# Altium project HIL_RIG_Hardware.PrjPcb (part 9 of 11)

## Sheet  12V.SchDoc
size A3; SheetNumber: 23; SheetTotal: 29; SPICEModelCacheJKCRVRTA: <root> / <DocumentId>JKCRVRTA</DocumentId> / </root>
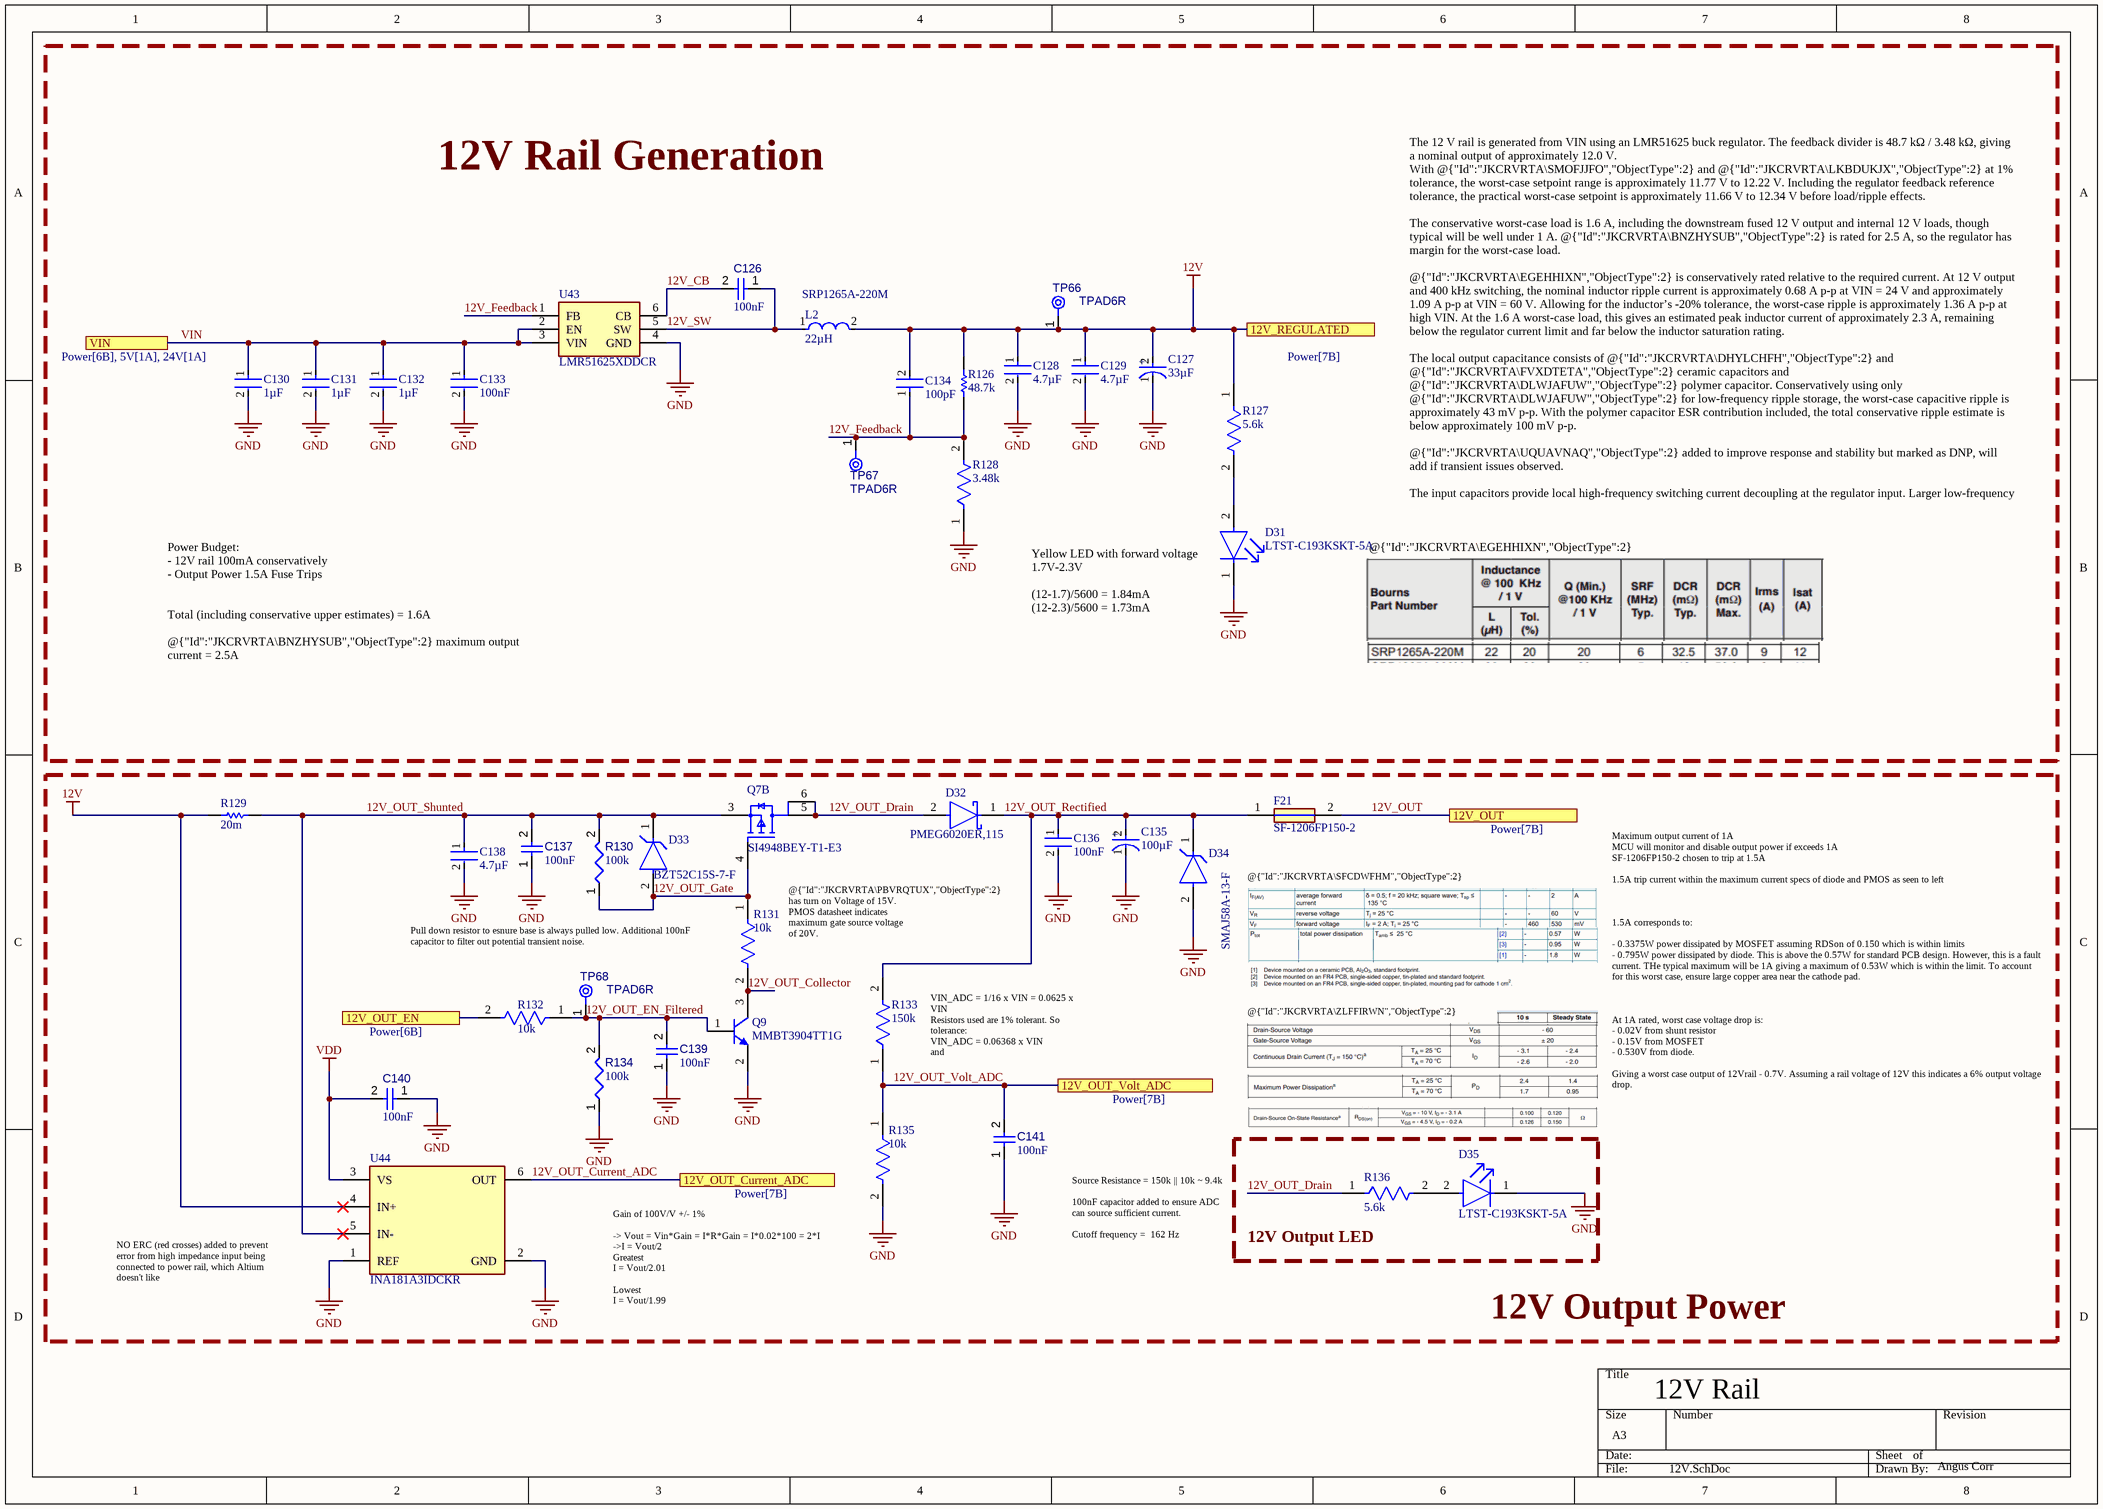
[diagram p21:  12V.SchDoc]

### Parts
C126  value 100nF  [CAPC1608X90X40NL10T20]  (hidden comment: Capacitor 100 nF +/-10% 50 V 0603)
C127  value 33µF  [FP-EEH-D8-MFG]  (hidden comment: EEHZA1H330XP)
C128  value 4.7µF  [FP-GRM21B-0_2-e0_2_0_7-MFG]  (hidden comment: GRM21BZ71H475KE15L)
C129  value 4.7µF  [FP-GRM21B-0_2-e0_2_0_7-MFG]  (hidden comment: GRM21BZ71H475KE15L)
C130  value 1µF  [FP-GRJ21B-0_35-MFG]  (hidden comment: GRJ21BC72A105KE11L)
C131  value 1µF  [FP-GRJ21B-0_35-MFG]  (hidden comment: GRJ21BC72A105KE11L)
C132  value 1µF  [FP-GRJ21B-0_35-MFG]  (hidden comment: GRJ21BC72A105KE11L)
C133  value 100nF  [FP-GRM31C-0_2-e0_3_0_8-IPC_C]  (hidden comment: GRM31C5C2A104JA01L)
C134  value 100pF  [FP-C0603C-CF-IPC_B]  (hidden comment: C0603C101F5HACTU)
C135  value 100µF  [FP-MVYAKE0-MFG]  (hidden comment: EMVY101ARA101MKE0S)
C136  value 100nF  [FP-GRM31C-0_2-e0_3_0_8-IPC_C]  (hidden comment: GRM31C5C2A104JA01L)
C137  value 100nF  [CAPC1608X90X40NL10T20]  (hidden comment: Capacitor 100 nF +/-10% 50 V 0603)
C138  value 4.7µF  [FP-GRM21B-0_2-e0_2_0_7-MFG]  (hidden comment: GRM21BZ71H475KE15L)
C139  value 100nF  [CAPC1608X90X40NL10T20]  (hidden comment: Capacitor 100 nF +/-10% 50 V 0603)
C140  value 100nF  [CAPC1608X90X40NL10T20]  (hidden comment: Capacitor 100 nF +/-10% 50 V 0603)
C141  value 100nF  [CAPC1608X90X40NL10T20]  (hidden comment: Capacitor 100 nF +/-10% 50 V 0603)
D31  LTST-C193KSKT-5A  [FP-LTST-C193KGKT-5A-MFG]
D32  PMEG6020ER,115  [FP-SOD123W-MFG]
D33  BZT52C15S-7-F  [FP-SOD323-IPC_A]
D34  SMAJ58A-13-F  [FP-SMA-MFG]
D35  LTST-C193KSKT-5A  [FP-LTST-C193KGKT-5A-MFG]
F21  SF-1206FP150-2  [FUSC3116X70N]
L2  value 22µH  [FP-SRP1265A-MFG]  (hidden comment: SRP1265A-220M)
Q7  SI4948BEY-T1-E3  [FP-C-06527-IPC_B]  (part B of 2)
Q9  MMBT3904TT1G  [ONSC-SC-75-3-463-01_V]
R126  value 48.7k  [RESC1608X55X25ML10T15]  (hidden comment: RC0603FR-0748K7L)
R127  value 5.6k  [FP-RT0603-IPC_C]  (hidden comment: RT0603FRE075K6L)
R128  value 3.48k  [FP-AC0603-IPC_C]  (hidden comment: AC0603FR-073K48L)
R129  value 20m  [RESC3216X89X51NL25T25]  (hidden comment: WSL1206R0200FEA)
R130  value 100k  [FP-AC0603-IPC_C]  (hidden comment: AC0603FR-07100KL)
R131  value 10k  [FP-RT0603-IPC_C]  (hidden comment: RT0603BRD0710KL)
R132  value 10k  [FP-RT0603-IPC_C]  (hidden comment: RT0603BRD0710KL)
R133  value 150k  [FP-CRGCQ0603-IPC_A]  (hidden comment: CRGCQ0603F150K)
R134  value 100k  [FP-AC0603-IPC_C]  (hidden comment: AC0603FR-07100KL)
R135  value 10k  [FP-RT0603-IPC_C]  (hidden comment: RT0603BRD0710KL)
R136  value 5.6k  [FP-RT0603-IPC_C]  (hidden comment: RT0603FRE075K6L)
TP66  TPAD6R  [TP06R]  (no BOM)
TP67  TPAD6R  [TP06R]  (no BOM)
TP68  TPAD6R  [TP06R]  (no BOM)
U43  LMR51625XDDCR  [SOT95P280X110-6N]
U44  INA181A3IDCKR  [FP-DCK0006A-IPC_A]

### Blocks framed on the sheet
12V Rail Generation: C126-C134 D31 L2 R126-R128 TP66 TP67 U43
12V Output Power: C135-C141 D32-D34 F21 Q7 Q9 R129-R135 TP68 U44
12V Output LED: D35 R136

### Ports
12V_OUT (see Power[7B]), 12V_OUT_Current_ADC (see Power[7B]), 12V_OUT_EN (see Power[6B]), 12V_OUT_Volt_ADC (see Power[7B]), 12V_REGULATED (see Power[7B]), VIN (see Power[6B], 5V[1A], 24V[1A])

### Nets
12V: C127.2(A) C128.1 C129.1 C134.2 L2.2 R126.2 R127.1 R129.1 TP66.1(TP) U44.4(IN+) ; port 12V_REGULATED
GND: C127.1(C) C128.2 C129.2 C130.2 C131.2 C132.2 C133.2 C135.1(C) C136.2 C137.1 C138.2 C139.1 C140.1 C141.1 D31.1(C) D34.2(A) D35.1(C) Q9.2(E) R128.1 R134.1 R135.2 U43.4(GND) U44.1(REF) U44.2(GND)
VDD: C140.2 U44.3(VS)
12V_CB: C126.2 U43.6(CB)
12V_Feedback: C134.1 R126.1 R128.2 TP67.1(TP) U43.1(FB)
12V_OUT: F21.2 ; port 12V_OUT
12V_OUT_Collector: Q9.3(C) R131.2
12V_OUT_Current_ADC: U44.6(OUT) ; port 12V_OUT_Current_ADC
12V_OUT_Drain: D32.2(A) Q7.5(D2) Q7.6(D2) R136.1
12V_OUT_EN_Filtered: C139.2 Q9.1(B) R132.1 R134.2 TP68.1(TP)
12V_OUT_Gate: D33.2(A) Q7.4(G2) R130.1 R131.1
12V_OUT_Rectified: C135.2(A) C136.1 D32.1(C) D34.1(C) F21.1 R133.2
12V_OUT_Shunted: C137.2 C138.1 D33.1(C) Q7.3(S2) R129.2 R130.2 U44.5(IN-)
12V_OUT_Volt_ADC: C141.2 R133.1 R135.1 ; port 12V_OUT_Volt_ADC
12V_SW: C126.1 L2.1 U43.5(SW)
VIN: C130.1 C131.1 C132.1 C133.1 U43.2(EN) U43.3(VIN) ; port VIN
NetD31_2: D31.2(A) R127.2
NetD35_2: D35.2(A) R136.2
NetR132_2: R132.2 ; port 12V_OUT_EN

### Notes on the sheet
- (near L2) SRP1265A-220M
- The 12 V rail is generated from VIN using an LMR51625 buck regulator. The feedback divider is 48.7 kΩ / 3.48 kΩ, giving a nominal output of approximately 12.0 V.
  With @{"Id":"JKCRVRTA\SMOFJJFO","ObjectType":2} and @{"Id":"JKCRVRTA\LKBDUKJX","ObjectType":2} at 1% tolerance, the worst-case setpoint range is approximately 11.77 V to 12.22 V. Including the regulator feedback reference tolerance, the practical worst-case setpoint is approximately 11.66 V to 12.34 V before load/ripple effects.
  The conservative worst-case load is 1.6 A, including the downstream fused 12 V output and internal 12 V loads, though typical will be well under 1 A. @{"Id":"JKCRVRTA\BNZHYSUB","ObjectType":2} is rated for 2.5 A, so the regulator has margin for the worst-case load.
  @{"Id":"JKCRVRTA\EGEHHIXN","ObjectType":2} is conservatively rated relative to the required current. At 12 V output and 400 kHz switching, the nominal inductor ripple current is approximately 0.68 A p-p at VIN = 24 V and approximately 1.09 A p-p at VIN = 60 V. Allowing for the inductor’s -20% tolerance, the worst-case ripple is approximately 1.36 A p-p at high VIN. At the 1.6 A worst-case load, this gives an estimated peak inductor current of approximately 2.3 A, remaining below the regulator current limit and far below the inductor saturation rating.
  The local output capacitance consists of @{"Id":"JKCRVRTA\DHYLCHFH","ObjectType":2} and @{"Id":"JKCRVRTA\FVXDTETA","ObjectType":2} ceramic capacitors and @{"Id":"JKCRVRTA\DLWJAFUW","ObjectType":2} polymer capacitor. Conservatively using only @{"Id":"JKCRVRTA\DLWJAFUW","ObjectType":2} for low-frequency ripple storage, the worst-case capacitive ripple is approximately 43 mV p-p. With the polymer capacitor ESR contribution included, the total conservative ripple estimate is below approximately 100 mV p-p.
  @{"Id":"JKCRVRTA\UQUAVNAQ","ObjectType":2} added to improve response and stability but marked as DNP, will add if transient issues observed.
  The input capacitors provide local high-frequency switching current decoupling at the regulator input. Larger low-frequency energy storage is provided by the upstream 100 µF bulk capacitance.
  VIN should remain comfortably above 12 V under load. In normal operation from the 24 V/VIN rail there is substantial duty-cycle margin, unlike the 24 V regulator which operates closer to dropout.
- @{"Id":"JKCRVRTA\EGEHHIXN","ObjectType":2} stats
- (near D31) Yellow LED with forward voltage 1.7V-2.3V
  (12-1.7)/5600 = 1.84mA
  (12-2.3)/5600 = 1.73mA
- Power Budget:
  - 12V rail 100mA conservatively
  - Output Power 1.5A Fuse Trips
  Total (including conservative upper estimates) = 1.6A
  @{"Id":"JKCRVRTA\BNZHYSUB","ObjectType":2} maximum output current = 2.5A
- @{"Id":"JKCRVRTA\SFCDWFHM","ObjectType":2} specs
- Pull down resistor to esnure base is always pulled low. Additional 100nF capacitor to filter out potential transient noise.
- @{"Id":"JKCRVRTA\PBVRQTUX","ObjectType":2} has turn on Voltage of 15V. PMOS datasheet indicates maximum gate source voltage of 20V.
- VIN_ADC = 1/16 x VIN = 0.0625 x VIN
  Resistors used are 1% tolerant. So tolerance:
  VIN_ADC = 0.06368 x VIN
  and
  VIN_ADC = 0.06238 x VIN
- @{"Id":"JKCRVRTA\ZLFFIRWN","ObjectType":2} specs
- Source Resistance = 150k || 10k ~ 9.4k
  100nF capacitor added to ensure ADC can source sufficient current.
  Cutoff frequency =  162 Hz
- Maximum output current of 1A
  MCU will monitor and disable output power if exceeds 1A
  SF-1206FP150-2 chosen to trip at 1.5A
  1.5A trip current within the maximum current specs of diode and PMOS as seen to left
  1.5A corresponds to:
  - 0.3375W power dissipated by MOSFET assuming RDSon of 0.150 which is within limits
  - 0.795W power dissipated by diode. This is above the 0.57W for standard PCB design. However, this is a fault current. THe typical maximum will be 1A giving a maximum of 0.53W which is within the limit. To account for this worst case, ensure large copper area near the cathode pad.
  At 1A rated, worst case voltage drop is:
  - 0.02V from shunt resistor
  - 0.15V from MOSFET
  - 0.530V from diode.
  Giving a worst case output of 12Vrail - 0.7V. Assuming a rail voltage of 12V this indicates a 6% output voltage drop.
- NO ERC (red crosses) added to prevent error from high impedance input being connected to power rail, which Altium doesn't like
- (near R135) Gain of 100V/V +/- 1%
  -> Vout = Vin*Gain = I*R*Gain = I*0.02*100 = 2*I
  ->I = Vout/2
  Greatest
  I = Vout/2.01
  Lowest
  I = Vout/1.99
- 12V Rail
- Angus Corr

### Library data of the parts
C126 C137 C139-C141 = CMP-001-00017-6: as C110 on sheet  24V; Tolerance: 10%; Mounting Technology: SM; Max Operating Temperature: 125°C; RoHS Compliant: True; Pins: 2; Case/Package: 0603; Min Operating Temperature: -55°C
C127 = CMP-001-00147-1: as C111 on sheet  24V; Max Operating Temperature: 105°C; Voltage Rating: 50V; Mounting Technology: Surface Mount; Pins: 8; Ripple Current: 1.6A; Tolerance: 20%; Min Operating Temperature: -55°C; Case/Package: Radial
C128 C129 C138 = CMP-001-00149-1: as C112 on sheet  24V; Case/Package: 0805; Tolerance: 10%; Voltage Rating: 50V; Min Operating Temperature: -55°C; Mounting Technology: Surface Mount; Max Operating Temperature: 125°C; Country of Origin: Japan, Mainland China, Philippines, Singapore, Thailand; Dielectric Material: Ceramic; Export Control Classification Number (ECCN) Code: EAR99; Harmonized Tariff Schedule (HTS) Code: 8532.24.00.20; Height: 1.25mm; Introduction Date: 2017-02-22; Length: 2mm; Lifecycle Status: Production; Material: Ceramic; Number of Terminals: 2; REACH SVHC: Yes; RoHS: Compliant; Thickness: 1.25mm; Voltage Rating (DC): 50V; Width: 1.25mm
C130-C132 = CMP-001-00143-2: as C114 on sheet  24V; Mounting Technology: Surface Mount; Voltage Rating: 100V; Max Operating Temperature: 125°C; Min Operating Temperature: -55°C; Tolerance: 10%; Case/Package: 0805; Case Code (Imperial): 0805; Case Code (Metric): 2012; Dielectric Material: Ceramic; Dielectric: X7S; Export Control Classification Number (ECCN) Code: EAR99; Features: Soft Termination; Harmonized Tariff Schedule (HTS) Code: 8532.24.00.20; Height: 1.25mm; Introduction Date: 2015-11-10; Length: 2mm; Lifecycle Status: Production; Material: Ceramic; Number of Terminals: 2; Packaging: Cut Tape; REACH SVHC: Yes; RoHS: Compliant; Schedule B: 8532240020, 8532240020; Thickness: 1.25mm; Voltage Rating (DC): 100V; Width: 1.25mm
C133 C136 = CMP-001-00103-1: as C117 on sheet  24V; Min Operating Temperature: -55°C; Mounting Technology: Surface Mount; Case/Package: 1206; Max Operating Temperature: 125°C; Tolerance: 5%; Voltage Rating: 100V
C134 = CMP-001-00115-1: Multilayer Ceramic Capacitors MLCC - SMD/SMT 50V 100pF X8R 0603 1%; Temperature Coefficient: 30ppm/°C; Lead Free: Lead Free; Width: 800µm; Schedule B: 8532240020, 8532240020; Introduction Date: 2017-10-02; Harmonized Tariff Schedule (HTS) Code: 8532.24.00.20; Voltage Rating (DC): 50V; Lifecycle Status: Production; Number of Terminals: 2; Height: 800µm; REACH SVHC: Yes; Dielectric Material: Ceramic; Country of Origin: Mexico; Voltage Rating: 50V; Mounting Technology: Surface Mount; Length: 1.6mm; China RoHS: Compliant; RoHS: Compliant; Case/Package: 0603; Max Operating Temperature: 150°C; Export Control Classification Number (ECCN) Code: EAR99; Dielectric: X8R; Material: Ceramic; Min Operating Temperature: -55°C
C135 = CMP-001-00104-1: as C119 on sheet  24V; Mounting Technology: Surface Mount; Ripple Current: 450mA; Tolerance: 20%; Case/Package: SMD/SMT; Pins: 2; Max Operating Temperature: 105°C; Min Operating Temperature: -40°C; Voltage Rating: 100V; Ripple Current (AC): 450mA
D31 D35 = CMP-007-00044-1: as D26 on sheet  24V; Schedule B: 8541402000, 8541402000; Introduction Date: 2007-04-09; Min Operating Temperature: -55°C; RoHS: Compliant; Terminal Pitch: 1.5mm; Case/Package: 0603; Width: 800µm; Dominant Wavelength: 594.5nm; Pins: 2; Case Code (Imperial): 0603; Height: 350µm; Length: 1.6mm; Color: Yellow; Lead Free: Lead Free; Max Operating Temperature: 85°C; Wavelength: 594.5nm; Harmonized Tariff Schedule (HTS) Code: 8541.40.20.00; China RoHS: Compliant; Illumination Color: Yellow; Number of Terminals: 2; Radiation Hardening: No; Case Code (Metric): 1608; Number of LEDs: 1; Depth: 800µm; Lifecycle Status: Production; REACH SVHC: Yes; Mounting Technology: Surface Mount; Number of Elements: 1
D32 = CMP-004-00064-1: as D27 on sheet  24V; Min Operating Temperature: -55°C; Max Operating Temperature: 150°C; Pins: 2
D33 = CMP-004-00045-1: as D28 on sheet  24V; Pins: 2; Max Operating Temperature: 150°C; Mounting Technology: Surface Mount; Min Operating Temperature: -65°C
D34 = CMP-004-00082-1: as D29 on sheet  24V; Case/Package: SMA; Max Operating Temperature: 150°C; Min Operating Temperature: -55°C; Mounting Technology: Surface Mount; Pins: 2
F21 = CMP-005-00025-1: as F20 on sheet  24V; Mouser Part Number: 652-SF-1206FP150-2; Mouser Price/Stock: https://www.mouser.co.uk/ProductDetail/Bourns/SF-1206FP150-2?qs=YCa%2FAAYMW02QT85STQYHfQ%3D%3D; Manufacturer_Part_Number: SF-1206FP150-2; Datasheet Link: https://www.arrow.com/en/products/sf-1206fp150-2/bourns; Source: MAX17643ATC+.SchLib; Arrow Part Number: SF-1206FP150-2; Design Item ID: SF-1206FP150-2; Height: 0.7mm; Arrow Price/Stock: https://www.arrow.com/en/products/sf-1206fp150-2/bourns?utm_currency=USD&region=nac
L2 = CMP-006-00026-1: Inductor Power Shielded Wirewound 22uH 20% 100KHz 20Q-Factor Carbonyl Powder 9A 0.037Ohm DCR Automotive T/R; Self Resonant Frequency: 6MHz; Min Operating Temperature: -55°C; Tolerance: 20%; Max Current Rating: 9A; Case/Package: Nonstandard; Max Operating Temperature: 150°C; Mounting Technology: Surface Mount; Current Rating: 9A
Q7 = CMP-013-00038-1: as Q7 on sheet  24V; Max Operating Temperature: 175°C; Mounting Technology: Surface Mount; Min Operating Temperature: -55°C; Case/Package: SO; Pins: 8
Q9 = CMP-013-00039-1: as Q8 on sheet  24V; Min Operating Temperature: -55°C; Max Operating Temperature: 150°C; Case/Package: SOT-416; Pins: 3
R126 = CMP-009-00329-1: Res Thick Film 0603 48.7K Ohm 1% 0.1W(1/10W) ±100ppm/C Pad SMD T/R; Working Voltage: 75V; Voltage Rating (DC): 50V; Temperature Coefficient: 100ppm/°C; Power Rating: 100mW; Length: 1.6mm; Lead Free: Lead Free; Composition: Thick Film; Termination: SMD/SMT; RoHS: Compliant; China RoHS: Non-Compliant; Depth: 800µm; Lifecycle Status: Production; Military Standard: Not; Min Operating Temperature: -55°C; Case Code (Imperial): 0603; Features: Moisture Resistant; Number of Terminals: 2; REACH SVHC: Yes; Mounting Technology: Surface Mount; Width: 800µm; Voltage Rating: 75V; Max Operating Temperature: 155°C; Max Power Dissipation: 100mW; Height: 450µm; Tolerance: 1%; Number of Terminations: 2; Schedule B: 8533210045, 8533210045; Case/Package: 0603
R127 R136 = CMP-009-00325-1: Fixed Resistor, Thin Film, 0.1W, 5600ohm, 75V, 1% +/-Tol, 50ppm/Cel, Surface Mount, 0603; Power Rating: 100mW; Temperature Coefficient: 50ppm/°C; Pins: 2; Tolerance: 1%; Lifecycle Status: Production; Composition: Thin Film; REACH SVHC: Yes; Working Voltage: 75V; Voltage Rating (DC): 75V; Case/Package: 0603; Voltage Rating: 75V; Mounting Technology: Surface Mount; Length: 1.6mm; Max Operating Temperature: 155°C; Number of Terminals: 2; Schedule B: 8533210045, 8533210045; Width: 800µm; China RoHS: Non-Compliant; Height: 450µm; Min Operating Temperature: -55°C; RoHS: Compliant; Case Code (Imperial): 0603; Depth: 800µm; Lead Free: Lead Free; Max Power Dissipation: 100mW; Military Standard: Not; Number of Terminations: 2; Termination: SMD/SMT
R128 = CMP-009-00282-1: as R117 on sheet  24V; Max Operating Temperature: 155°C; Mounting Technology: Surface Mount; Min Operating Temperature: -55°C; Tolerance: 1%; Case/Package: 0603
R129 = CMP-009-00308-1: as R118 on sheet  24V; Pins: 2; Min Operating Temperature: -65°C; Tolerance: 1%; Mounting Technology: Surface Mount; Max Operating Temperature: 170°C; Case/Package: 1206
R130 R134 = CMP-009-00345-3: as R115 on sheet  24V; Max Operating Temperature: 155°C; Tolerance: 1%; Case/Package: 0603; Mounting Technology: Surface Mount; Min Operating Temperature: -55°C; Case Code (Imperial): 0603; Case Code (Metric): 1608; China RoHS: Non-Compliant; Composition: Thick Film; Country of Origin: Mainland China, Taiwan; Depth: 800µm; Export Control Classification Number (ECCN) Code: EAR99; Features: Anti-Sulfur, Automotive AEC-Q200, Moisture Resistant; Harmonized Tariff Schedule (HTS) Code: 8533.21.00.30; Height: 450µm; Introduction Date: 2012-04-10; Lead Free: Lead Free; Length: 1.6mm; Lifecycle Status: Production; Military Standard: Not; Number of Terminals: 2; Number of Terminations: 2; Packaging: Tape & Reel; Power Rating: 100mW; Ratings: AEC-Q200; REACH SVHC: Yes; RoHS: Compliant; Schedule B: 8533210045, 8533210045; Termination: SMD/SMT; Width: 800µm; Working Voltage: 75V
R131 R132 R135 = CMP-009-00322-1: as R120 on sheet  24V; Min Operating Temperature: -55°C; Case/Package: 0603; Mounting Technology: Surface Mount; Max Operating Temperature: 155°C; Tolerance: 0.1%; Case Code (Imperial): 0603; China RoHS: Non-Compliant; Composition: Thin Film; Country of Origin: Mainland China, Taiwan; Depth: 800µm; Export Control Classification Number (ECCN) Code: EAR99; Features: Moisture Resistant; Harmonized Tariff Schedule (HTS) Code: 8533.21.00.30; Height: 450µm; Introduction Date: 2008-06-09; Lead Free: Lead Free; Length: 1.6mm; Lifecycle Status: Production; Military Standard: Not; Number of Terminals: 2; Number of Terminations: 2; Power Rating: 100mW; REACH SVHC: Yes; RoHS: Compliant; Schedule B: 8533210045, 8533210045; Termination: SMD/SMT; Voltage Rating (DC): 75V; Weight: 2.012816mg; Width: 800µm; Working Voltage: 75V
R133 = CMP-009-00207-1: as R122 on sheet  24V; Mounting Technology: Surface Mount; Case/Package: 0603; Min Operating Temperature: -55°C; Max Operating Temperature: 155°C; Tolerance: 1%
TP66-TP68 = CMP-00028-00002-2: 0.6mm round; Pins: 1
U43 = CMP-031-00022-1: as U41 on sheet  24V; Source: MAX17643ATC+.SchLib; Mouser Part Number: 595-LMR51625XDDCR; Manufacturer_Part_Number: LMR51625XDDCR; Arrow Price/Stock: https://www.arrow.com/en/products/lmr51625xddcr/texas-instruments.html?utm_currency=USD&region=nac; Mouser Price/Stock: https://www.mouser.co.uk/ProductDetail/Texas-Instruments/LMR51625XDDCR?qs=efUn273yAheKjJQ13bmSQQ%3D%3D; Height: 1.1mm; Datasheet Link: https://www.ti.com/lit/ds/symlink/lmr51625.pdf?ts=1740555768028; Arrow Part Number: LMR51625XDDCR; Design Item ID: LMR51625XDDCR
U44 = CMP-014-00006-1: as U42 on sheet  24V; Min Operating Temperature: -40°C; Pins: 6; Max Operating Temperature: 125°C

## Sheet  5V.SchDoc
size A3; SheetNumber: 24; SheetTotal: 29; SPICEModelCacheHUIZGDZF: <root> / <DocumentId>HUIZGDZF</DocumentId> / </root>
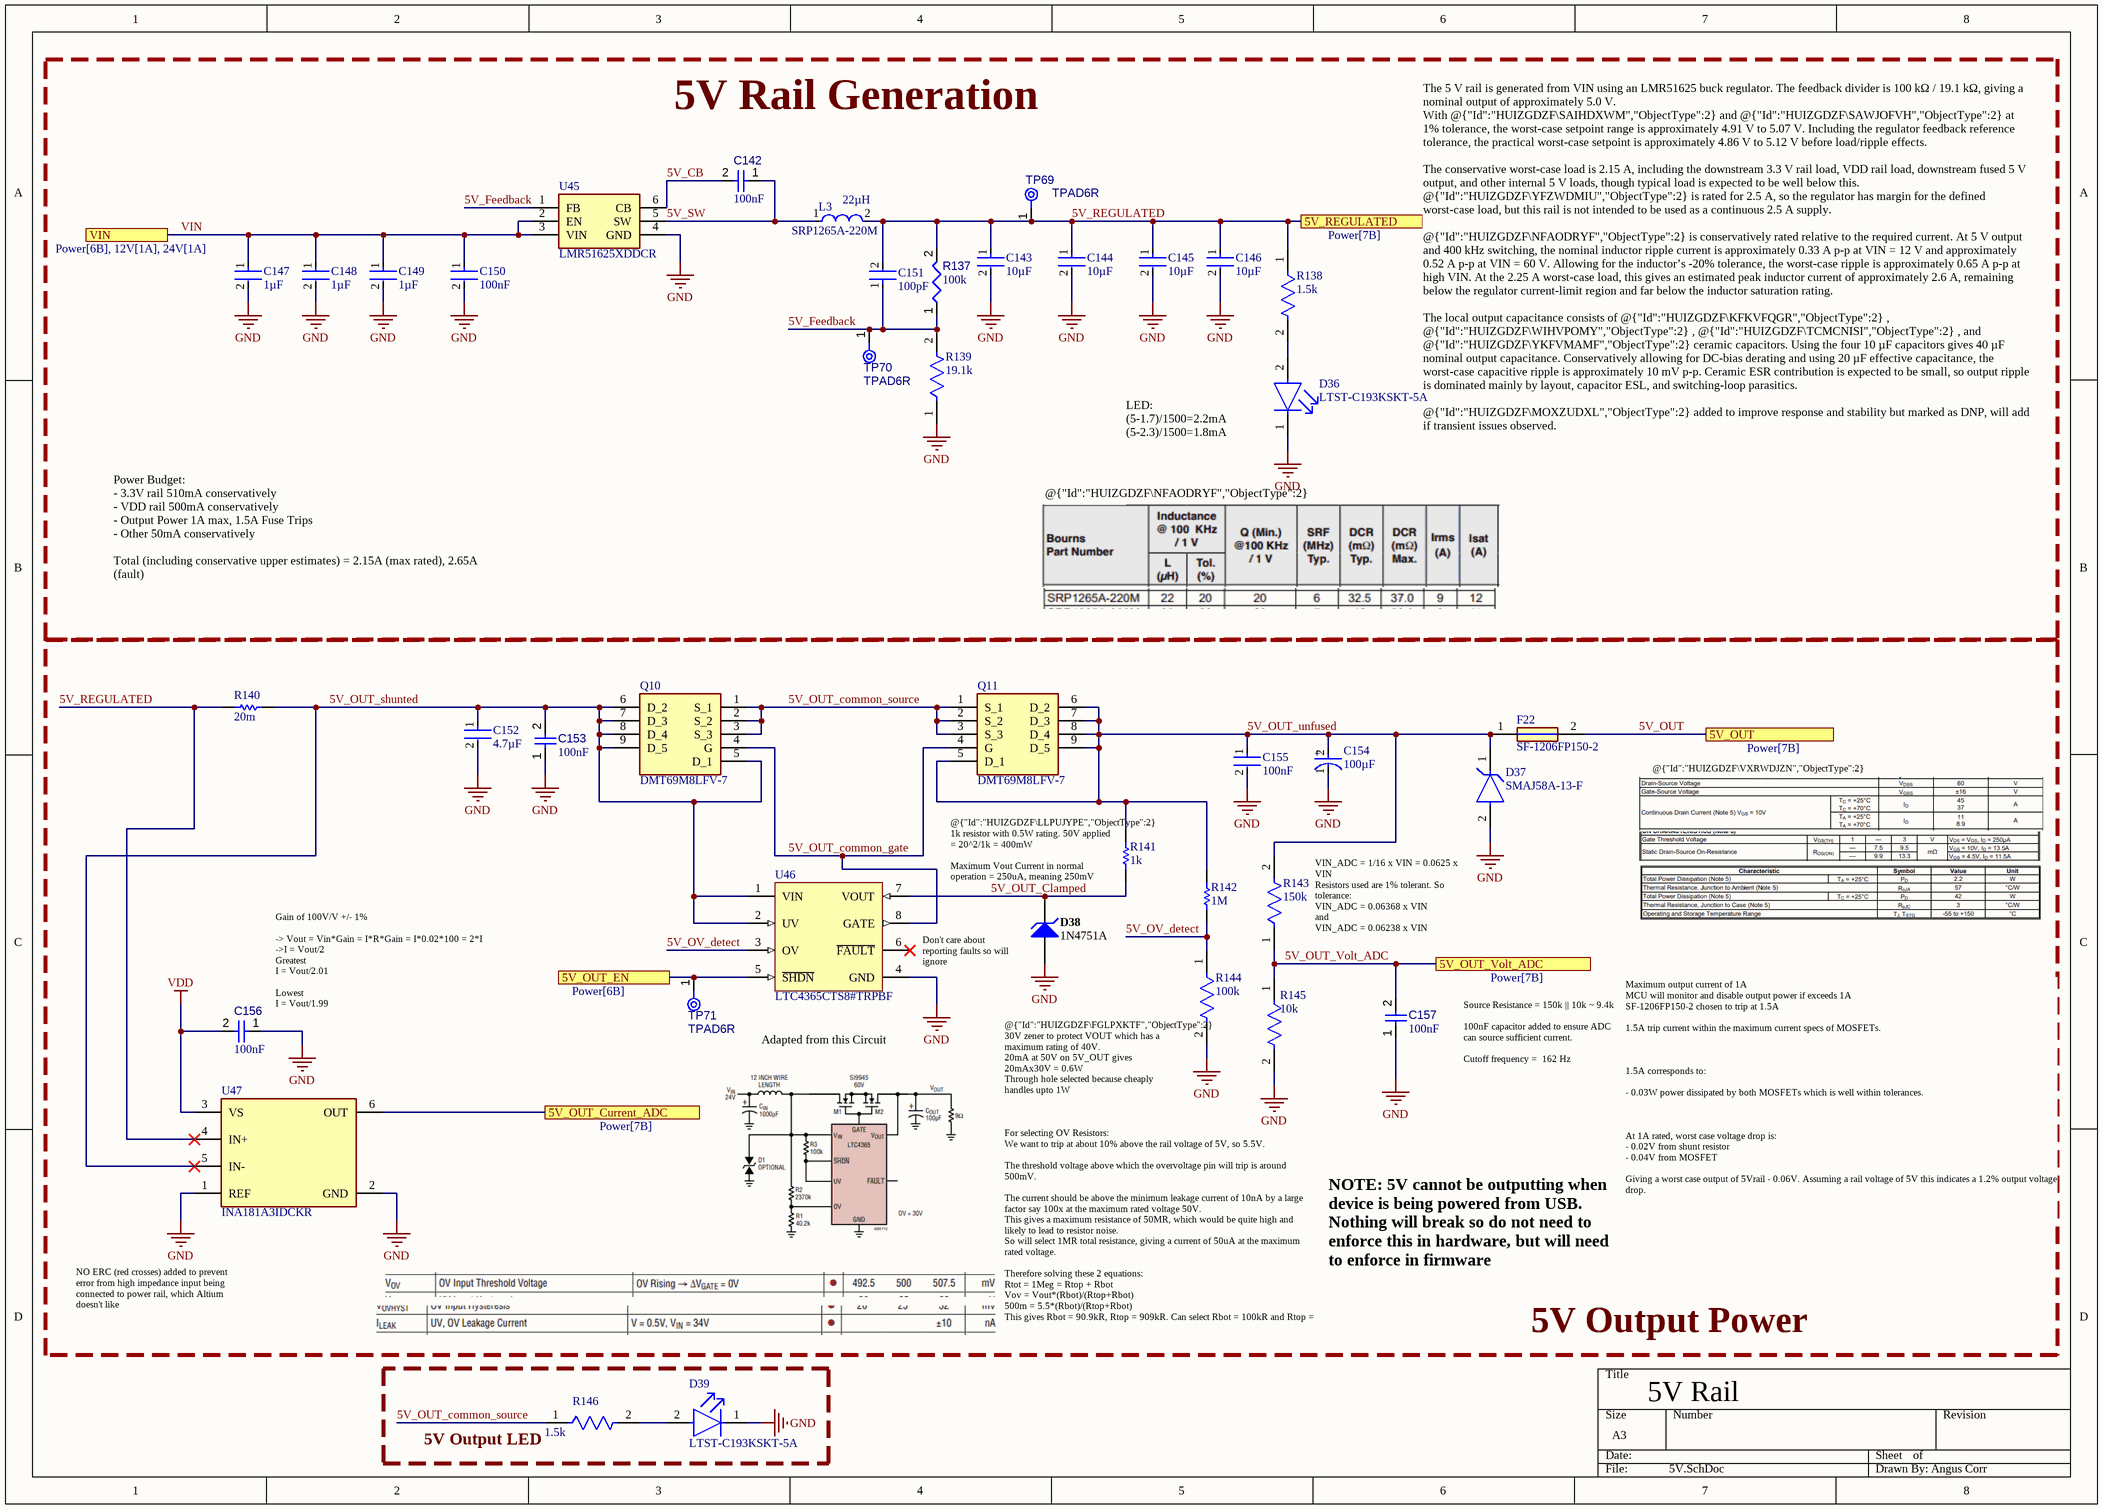
[diagram p22:  5V.SchDoc]

### Parts
C142  value 100nF  [CAPC1608X90X40NL10T20]  (hidden comment: Capacitor 100 nF +/-10% 50 V 0603)
C143  value 10µF  [FP-GRM31C-0_2-e0_3_0_8-IPC_C]  (hidden comment: GRM31CR71E106KA12L)
C144  value 10µF  [FP-GRM31C-0_2-e0_3_0_8-IPC_C]  (hidden comment: GRM31CR71E106KA12L)
C145  value 10µF  [FP-GRM31C-0_2-e0_3_0_8-IPC_C]  (hidden comment: GRM31CR71E106KA12L)
C146  value 10µF  [FP-GRM31C-0_2-e0_3_0_8-IPC_C]  (hidden comment: GRM31CR71E106KA12L)
C147  value 1µF  [FP-GRJ21B-0_35-MFG]  (hidden comment: GRJ21BC72A105KE11L)
C148  value 1µF  [FP-GRJ21B-0_35-MFG]  (hidden comment: GRJ21BC72A105KE11L)
C149  value 1µF  [FP-GRJ21B-0_35-MFG]  (hidden comment: GRJ21BC72A105KE11L)
C150  value 100nF  [FP-GRM31C-0_2-e0_3_0_8-IPC_C]  (hidden comment: GRM31C5C2A104JA01L)
C151  value 100pF  [FP-C0603C-CF-IPC_B]  (hidden comment: C0603C101F5HACTU)
C152  value 4.7µF  [FP-GRM21B-0_2-e0_2_0_7-MFG]  (hidden comment: GRM21BZ71H475KE15L)
C153  value 100nF  [CAPC1608X90X40NL10T20]  (hidden comment: Capacitor 100 nF +/-10% 50 V 0603)
C154  value 100µF  [FP-MVYAKE0-MFG]  (hidden comment: EMVY101ARA101MKE0S)
C155  value 100nF  [FP-GRM31C-0_2-e0_3_0_8-IPC_C]  (hidden comment: GRM31C5C2A104JA01L)
C156  value 100nF  [CAPC1608X90X40NL10T20]  (hidden comment: Capacitor 100 nF +/-10% 50 V 0603)
C157  value 100nF  [CAPC1608X90X40NL10T20]  (hidden comment: Capacitor 100 nF +/-10% 50 V 0603)
D36  LTST-C193KSKT-5A  [FP-LTST-C193KGKT-5A-MFG]
D37  SMAJ58A-13-F  [FP-SMA-MFG]
D38  1N4751A  [FAIR-DO-41-2_V]
D39  LTST-C193KSKT-5A  [FP-LTST-C193KGKT-5A-MFG]
F22  SF-1206FP150-2  [FUSC3116X70N]
L3  SRP1265A-220M  value 22µH  [FP-SRP1265A-MFG]
Q10  DMT69M8LFV-7  [DMP3036SFV7]
Q11  DMT69M8LFV-7  [DMP3036SFV7]
R137  value 100k  [FP-AC0603-IPC_C]  (hidden comment: AC0603FR-07100KL)
R138  value 1.5k  [FP-RT0603-IPC_C]  (hidden comment: RT0603BRD071K5L)
R139  value 19.1k  [FP-RT0603-IPC_C]  (hidden comment: RT0603BRD0719K1L)
R140  value 20m  [RESC3216X89X51NL25T25]  (hidden comment: WSL1206R0200FEA)
R141  value 1k  [RESC3126X60X50ML10T20]  (hidden comment: AC1210FR-071KL)
R142  value 1M  [RESC2013X60X35ML10T20]  (hidden comment: RT0805BRD071ML)
R143  value 150k  [FP-CRGCQ0603-IPC_A]  (hidden comment: CRGCQ0603F150K)
R144  value 100k  [FP-RT0603-IPC_C]  (hidden comment: RT0603BRE07100KL)
R145  value 10k  [FP-RT0603-IPC_C]  (hidden comment: RT0603BRD0710KL)
R146  value 1.5k  [FP-RT0603-IPC_C]  (hidden comment: RT0603BRD071K5L)
TP69  TPAD6R  [TP06R]  (no BOM)
TP70  TPAD6R  [TP06R]  (no BOM)
TP71  TPAD6R  [TP06R]  (no BOM)
U45  LMR51625XDDCR  [SOT95P280X110-6N]
U46  LTC4365CTS8#TRPBF  [LT-TS8-8-TSOT-23_V]
U47  INA181A3IDCKR  [FP-DCK0006A-IPC_A]

### Blocks framed on the sheet
5V Output Power: C152-C157 D37 D38 F22 Q10 Q11 R140-R145 TP71 U46 U47
5V Output LED: D39 R146

### Ports
5V_OUT (see Power[7B]), 5V_OUT_Current_ADC (see Power[7B]), 5V_OUT_EN (see Power[6B]), 5V_OUT_Volt_ADC (see Power[7B]), 5V_REGULATED (see Power[7B]), VIN (see Power[6B], 12V[1A], 24V[1A])

### Nets
GND: C143.2 C144.2 C145.2 C146.2 C147.2 C148.2 C149.2 C150.2 C152.2 C153.1 C154.1(C) C155.2 C156.1 C157.1 D36.1(C) D37.2(A) D38.1(A) D39.1(C) R139.1 R144.2 R145.2 U45.4(GND) U46.4(GND) U47.1(REF) U47.2(GND)
VDD: C156.2 U47.3(VS)
5V_CB: C142.2 U45.6(CB)
5V_Feedback: C151.1 R137.1 R139.2 TP70.1(TP) U45.1(FB)
5V_OUT: F22.2 ; port 5V_OUT
5V_OUT_Clamped: D38.2(K) R141.1 U46.7(VOUT)
5V_OUT_common_gate: Q10.4(G) Q11.4(G) U46.8(GATE)
5V_OUT_common_source: Q10.1(S_1) Q10.2(S_2) Q10.3(S_3) Q11.1(S_1) Q11.2(S_2) Q11.3(S_3) R146.1
5V_OUT_shunted: C152.1 C153.2 Q10.5(D_1) Q10.6(D_2) Q10.7(D_3) Q10.8(D_4) Q10.9(D_5) R140.2 U46.1(VIN) U46.2(UV) U47.5(IN-)
5V_OUT_unfused: C154.2(A) C155.1 D37.1(C) F22.1 Q11.5(D_1) Q11.6(D_2) Q11.7(D_3) Q11.8(D_4) Q11.9(D_5) R141.2 R142.1 R143.2
5V_OUT_Volt_ADC: C157.2 R143.1 R145.1 ; port 5V_OUT_Volt_ADC
5V_OV_detect: R142.2 R144.1 U46.3(OV)
5V_REGULATED: C143.1 C144.1 C145.1 C146.1 C151.2 L3.2 R137.2 R138.1 R140.1 TP69.1(TP) U47.4(IN+) ; port 5V_REGULATED
5V_SW: C142.1 L3.1 U45.5(SW)
VIN: C147.1 C148.1 C149.1 C150.1 U45.2(EN) U45.3(VIN) ; port VIN
NetD36_2: D36.2(A) R138.2
NetD39_2: D39.2(A) R146.2
NetTP71_1: TP71.1(TP) U46.5(~{SHDN}) ; port 5V_OUT_EN
NetU47_6: U47.6(OUT) ; port 5V_OUT_Current_ADC

Not connected (* = marked no-connect by the designer): U46 6(~{FAULT})*

### Notes on the sheet
- 5V Rail Generation
- (near D36) LED:
  (5-1.7)/1500=2.2mA
  (5-2.3)/1500=1.8mA
- The 5 V rail is generated from VIN using an LMR51625 buck regulator. The feedback divider is 100 kΩ / 19.1 kΩ, giving a nominal output of approximately 5.0 V.
  With @{"Id":"HUIZGDZF\SAIHDXWM","ObjectType":2} and @{"Id":"HUIZGDZF\SAWJOFVH","ObjectType":2} at 1% tolerance, the worst-case setpoint range is approximately 4.91 V to 5.07 V. Including the regulator feedback reference tolerance, the practical worst-case setpoint is approximately 4.86 V to 5.12 V before load/ripple effects.
  The conservative worst-case load is 2.15 A, including the downstream 3.3 V rail load, VDD rail load, downstream fused 5 V output, and other internal 5 V loads, though typical load is expected to be well below this. @{"Id":"HUIZGDZF\YFZWDMIU","ObjectType":2} is rated for 2.5 A, so the regulator has margin for the defined worst-case load, but this rail is not intended to be used as a continuous 2.5 A supply.
  @{"Id":"HUIZGDZF\NFAODRYF","ObjectType":2} is conservatively rated relative to the required current. At 5 V output and 400 kHz switching, the nominal inductor ripple current is approximately 0.33 A p-p at VIN = 12 V and approximately 0.52 A p-p at VIN = 60 V. Allowing for the inductor’s -20% tolerance, the worst-case ripple is approximately 0.65 A p-p at high VIN. At the 2.25 A worst-case load, this gives an estimated peak inductor current of approximately 2.6 A, remaining below the regulator current-limit region and far below the inductor saturation rating.
  The local output capacitance consists of @{"Id":"HUIZGDZF\KFKVFQGR","ObjectType":2} , @{"Id":"HUIZGDZF\WIHVPOMY","ObjectType":2} , @{"Id":"HUIZGDZF\TCMCNISI","ObjectType":2} , and @{"Id":"HUIZGDZF\YKFVMAMF","ObjectType":2} ceramic capacitors. Using the four 10 µF capacitors gives 40 µF nominal output capacitance. Conservatively allowing for DC-bias derating and using 20 µF effective capacitance, the worst-case capacitive ripple is approximately 10 mV p-p. Ceramic ESR contribution is expected to be small, so output ripple is dominated mainly by layout, capacitor ESL, and switching-loop parasitics.
  @{"Id":"HUIZGDZF\MOXZUDXL","ObjectType":2} added to improve response and stability but marked as DNP, will add if transient issues observed.
  The input capacitors provide local high-frequency switching current decoupling at the regulator input. Larger low-frequency energy storage is provided by the upstream 100 µF bulk capacitance.
  VIN should remain comfortably above 5 V under load. In normal operation from the 12 V, 24 V, or higher VIN rail there is substantial duty-cycle margin. This regulator cannot maintain a regulated 5 V output if VIN is only 5 V or close to 5 V.
- @{"Id":"HUIZGDZF\NFAODRYF","ObjectType":2} stats
- Power Budget:
  - 3.3V rail 510mA conservatively
  - VDD rail 500mA conservatively
  - Output Power 1A max, 1.5A Fuse Trips
  - Other 50mA conservatively
  Total (including conservative upper estimates) = 2.15A (max rated), 2.65A (fault)
  @{"Id":"HUIZGDZF\IJKQQVES","ObjectType":2} maximum output current = 2.5A
- @{"Id":"HUIZGDZF\VXRWDJZN","ObjectType":2} and @{"Id":"HUIZGDZF\HZYFBJOE","ObjectType":2} specs
- (near R141) @{"Id":"HUIZGDZF\LLPUJYPE","ObjectType":2} 1k resistor with 0.5W rating. 50V applied = 20^2/1k = 400mW
  Maximum Vout Current in normal operation = 250uA, meaning 250mV drop at Vout
- Don't care about reporting faults so will ignore
- VIN_ADC = 1/16 x VIN = 0.0625 x VIN
  Resistors used are 1% tolerant. So tolerance:
  VIN_ADC = 0.06368 x VIN
  and
  VIN_ADC = 0.06238 x VIN
- (near C156) Gain of 100V/V +/- 1%
  -> Vout = Vin*Gain = I*R*Gain = I*0.02*100 = 2*I
  ->I = Vout/2
  Greatest
  I = Vout/2.01
  Lowest
  I = Vout/1.99
- Adapted from this Circuit
- (near R144) @{"Id":"HUIZGDZF\FGLPXKTF","ObjectType":2} 30V zener to protect VOUT which has a maximum rating of 40V.
  20mA at 50V on 5V_OUT gives 20mAx30V = 0.6W
  Through hole selected because cheaply handles upto 1W
- Source Resistance = 150k || 10k ~ 9.4k
  100nF capacitor added to ensure ADC can source sufficient current.
  Cutoff frequency =  162 Hz
- Maximum output current of 1A
  MCU will monitor and disable output power if exceeds 1A
  SF-1206FP150-2 chosen to trip at 1.5A
  1.5A trip current within the maximum current specs of MOSFETs.
  1.5A corresponds to:
  - 0.03W power dissipated by both MOSFETs which is well within tolerances.
  At 1A rated, worst case voltage drop is:
  - 0.02V from shunt resistor
  - 0.04V from MOSFET
  Giving a worst case output of 5Vrail - 0.06V. Assuming a rail voltage of 5V this indicates a 1.2% output voltage drop.
- NO ERC (red crosses) added to prevent error from high impedance input being connected to power rail, which Altium doesn't like
- For selecting OV Resistors:
  We want to trip at about 10% above the rail voltage of 5V, so 5.5V.
  The threshold voltage above which the overvoltage pin will trip is around 500mV.
  The current should be above the minimum leakage current of 10nA by a large factor say 100x at the maximum rated voltage 50V.
  This gives a maximum resistance of 50MR, which would be quite high and likely to lead to resistor noise.
  So will select 1MR total resistance, giving a current of 50uA at the maximum rated voltage.
  Therefore solving these 2 equations:
  Rtot = 1Meg = Rtop + Rbot
  Vov = Vout*(Rbot)/(Rtop+Rbot)
  500m = 5.5*(Rbot)/(Rtop+Rbot)
  This gives Rbot = 90.9kR, Rtop = 909kR. Can select Rbot = 100kR and Rtop = 1MR
- NOTE: 5V cannot be outputting when device is being powered from USB. Nothing will break so do not need to enforce this in hardware, but will need to enforce in firmware
- 5V Rail
- Angus Corr

### Library data of the parts
C142 C153 C156 C157 = CMP-001-00017-6: as C110 on sheet  24V; Tolerance: 10%; Mounting Technology: SM; Max Operating Temperature: 125°C; RoHS Compliant: True; Pins: 2; Case/Package: 0603; Min Operating Temperature: -55°C
C143-C146 = CMP-001-00139-1: 25V 10uF X7R ±10% 1206 Multilayer Ceramic Capacitors MLCC - SMD/SMT ROHS; Manufacturer Lifecycle Status: IN PRODUCTION; Min Operating Temperature: -55°C; Case/Package: 1206; Pins: 2; Voltage Rating: 25V; Max Operating Temperature: 125°C; Tolerance: 10%; Mounting Technology: Surface Mount; Case Code (Imperial): 1206; Case Code (Metric): 3216; China RoHS: Compliant; Depth: 1.6mm; Dielectric Material: Ceramic; Dielectric: X7R; Height: 1.6mm; Lead Free: Lead Free; Length: 3.2mm; Lifecycle Status: Production; Material: Ceramic; Number of Terminals: 2; Packaging: Cut Tape; Radiation Hardening: No; REACH SVHC: Yes; RoHS: Compliant; Schedule B: 8532240020, 8532240020; Termination: SMD/SMT; Thickness: 1.6mm; Voltage Rating (DC): 25V; Voltage: 25V; Width: 1.6mm
C147-C149 = CMP-001-00143-2: as C114 on sheet  24V; Mounting Technology: Surface Mount; Voltage Rating: 100V; Max Operating Temperature: 125°C; Min Operating Temperature: -55°C; Tolerance: 10%; Case/Package: 0805; Case Code (Imperial): 0805; Case Code (Metric): 2012; Dielectric Material: Ceramic; Dielectric: X7S; Export Control Classification Number (ECCN) Code: EAR99; Features: Soft Termination; Harmonized Tariff Schedule (HTS) Code: 8532.24.00.20; Height: 1.25mm; Introduction Date: 2015-11-10; Length: 2mm; Lifecycle Status: Production; Material: Ceramic; Number of Terminals: 2; Packaging: Cut Tape; REACH SVHC: Yes; RoHS: Compliant; Schedule B: 8532240020, 8532240020; Thickness: 1.25mm; Voltage Rating (DC): 100V; Width: 1.25mm
C150 C155 = CMP-001-00103-1: as C117 on sheet  24V; Min Operating Temperature: -55°C; Mounting Technology: Surface Mount; Case/Package: 1206; Max Operating Temperature: 125°C; Tolerance: 5%; Voltage Rating: 100V
C151 = CMP-001-00115-1: as C134 on sheet  12V; Lead Free: Lead Free; Width: 800µm; Schedule B: 8532240020, 8532240020; Introduction Date: 2017-10-02; Harmonized Tariff Schedule (HTS) Code: 8532.24.00.20; Voltage Rating (DC): 50V; Lifecycle Status: Production; Number of Terminals: 2; Height: 800µm; REACH SVHC: Yes; Dielectric Material: Ceramic; Country of Origin: Mexico; Voltage Rating: 50V; Mounting Technology: Surface Mount; Length: 1.6mm; China RoHS: Compliant; RoHS: Compliant; Case/Package: 0603; Max Operating Temperature: 150°C; Export Control Classification Number (ECCN) Code: EAR99; Dielectric: X8R; Material: Ceramic; Min Operating Temperature: -55°C
C152 = CMP-001-00149-1: as C112 on sheet  24V; Case/Package: 0805; Tolerance: 10%; Voltage Rating: 50V; Min Operating Temperature: -55°C; Mounting Technology: Surface Mount; Max Operating Temperature: 125°C; Country of Origin: Japan, Mainland China, Philippines, Singapore, Thailand; Dielectric Material: Ceramic; Export Control Classification Number (ECCN) Code: EAR99; Harmonized Tariff Schedule (HTS) Code: 8532.24.00.20; Height: 1.25mm; Introduction Date: 2017-02-22; Length: 2mm; Lifecycle Status: Production; Material: Ceramic; Number of Terminals: 2; REACH SVHC: Yes; RoHS: Compliant; Thickness: 1.25mm; Voltage Rating (DC): 50V; Width: 1.25mm
C154 = CMP-001-00104-1: as C119 on sheet  24V; Mounting Technology: Surface Mount; Ripple Current: 450mA; Tolerance: 20%; Case/Package: SMD/SMT; Pins: 2; Max Operating Temperature: 105°C; Min Operating Temperature: -40°C; Voltage Rating: 100V; Ripple Current (AC): 450mA
D36 D39 = CMP-007-00044-1: as D26 on sheet  24V; Schedule B: 8541402000, 8541402000; Introduction Date: 2007-04-09; Min Operating Temperature: -55°C; RoHS: Compliant; Terminal Pitch: 1.5mm; Case/Package: 0603; Width: 800µm; Dominant Wavelength: 594.5nm; Pins: 2; Case Code (Imperial): 0603; Height: 350µm; Length: 1.6mm; Color: Yellow; Lead Free: Lead Free; Max Operating Temperature: 85°C; Wavelength: 594.5nm; Harmonized Tariff Schedule (HTS) Code: 8541.40.20.00; China RoHS: Compliant; Illumination Color: Yellow; Number of Terminals: 2; Radiation Hardening: No; Case Code (Metric): 1608; Number of LEDs: 1; Depth: 800µm; Lifecycle Status: Production; REACH SVHC: Yes; Mounting Technology: Surface Mount; Number of Elements: 1
D37 = CMP-004-00082-1: as D29 on sheet  24V; Case/Package: SMA; Max Operating Temperature: 150°C; Min Operating Temperature: -55°C; Mounting Technology: Surface Mount; Pins: 2
D38 = CMP-004-00059-1: 1N4751 Series 1 W 30 V 5 uA Axial Through Hole Zener Diode - DO-41; Case/Package: DO-41-2; Max Operating Temperature: 200°C; Pins: 2; Mounting Technology: Through Hole; Min Operating Temperature: -65°C
F22 = CMP-005-00025-1: as F20 on sheet  24V; Mouser Part Number: 652-SF-1206FP150-2; Mouser Price/Stock: https://www.mouser.co.uk/ProductDetail/Bourns/SF-1206FP150-2?qs=YCa%2FAAYMW02QT85STQYHfQ%3D%3D; Manufacturer_Part_Number: SF-1206FP150-2; Datasheet Link: https://www.arrow.com/en/products/sf-1206fp150-2/bourns; Source: MAX17643ATC+.SchLib; Arrow Part Number: SF-1206FP150-2; Design Item ID: SF-1206FP150-2; Height: 0.7mm; Arrow Price/Stock: https://www.arrow.com/en/products/sf-1206fp150-2/bourns?utm_currency=USD&region=nac
L3 = CMP-006-00026-1: as L2 on sheet  12V; Min Operating Temperature: -55°C; Tolerance: 20%; Max Current Rating: 9A; Case/Package: Nonstandard; Max Operating Temperature: 150°C; Mounting Technology: Surface Mount; Current Rating: 9A
Q10 Q11 = CMP-033-000000-1: MOSFET MOSFET BVDSS: 41V-60V; Manufacturer_Name: Diodes Incorporated; Arrow Part Number: DMT69M8LFV-7; Datasheet Link: https://4donline.ihs.com/images/VipMasterIC/IC/DIOD/DIOD-S-A0005038932/DIOD-S-A0005038932-1.pdf?hkey=CECEF36DEECDED6468708AAF2E19C0C6; Mouser Part Number: 621-DMT69M8LFV-7; Mouser Price/Stock: https://www.mouser.com/Search/Refine.aspx?Keyword=621-DMT69M8LFV-7; Arrow Price/Stock: https://www.arrow.com/en/products/dmt69m8lfv-7/diodes-incorporated; Manufacturer_Part_Number: DMT69M8LFV-7; Source: MAX17643ATC+.SchLib; Design Item ID: DMT69M8LFV-7
R137 = CMP-009-00345-3: as R115 on sheet  24V; Max Operating Temperature: 155°C; Tolerance: 1%; Case/Package: 0603; Mounting Technology: Surface Mount; Min Operating Temperature: -55°C; Case Code (Imperial): 0603; Case Code (Metric): 1608; China RoHS: Non-Compliant; Composition: Thick Film; Country of Origin: Mainland China, Taiwan; Depth: 800µm; Export Control Classification Number (ECCN) Code: EAR99; Features: Anti-Sulfur, Automotive AEC-Q200, Moisture Resistant; Harmonized Tariff Schedule (HTS) Code: 8533.21.00.30; Height: 450µm; Introduction Date: 2012-04-10; Lead Free: Lead Free; Length: 1.6mm; Lifecycle Status: Production; Military Standard: Not; Number of Terminals: 2; Number of Terminations: 2; Packaging: Tape & Reel; Power Rating: 100mW; Ratings: AEC-Q200; REACH SVHC: Yes; RoHS: Compliant; Schedule B: 8533210045, 8533210045; Termination: SMD/SMT; Width: 800µm; Working Voltage: 75V
R138 = CMP-009-00351-1: Res Thin Film 0603 1.5K Ohm 0.1% 1/10W ±25ppm/°C Molded SMD SMD Paper T/R; Power Rating: 100mW; Voltage Rating: 75V; Voltage Rating (DC): 50V; Schedule B: 8533210045, 8533210045; Max Operating Temperature: 155°C; Tolerance: 0.1%; Case/Package: 0603; Width: 800µm; Composition: Thin Film; Number of Terminals: 2; Lifecycle Status: Production; REACH SVHC: Yes; Working Voltage: 75V; Height: 450µm; RoHS: Compliant; Temperature Coefficient: 25ppm/°C; Length: 1.6mm; Min Operating Temperature: -55°C; China RoHS: Non-Compliant; Mounting Technology: Surface Mount; Case Code (Imperial): 0603; Contact Plating: Tin; Depth: 800µm; Features: Moisture Resistant; Lead Free: Lead Free; Max Power Dissipation: 100mW; Military Standard: Not; Number of Terminations: 2; Radiation Hardening: No; Termination: SMD/SMT; Country of Origin: Mainland China, Taiwan; Export Control Classification Number (ECCN) Code: EAR99; Harmonized Tariff Schedule (HTS) Code: 8533.21.00.30; Introduction Date: 2008-06-09
R139 = CMP-009-00352-1: 100mW Thin Film Resistor ±25ppm/℃ ±0.1% 19.1kΩ 0603 Chip Resistor - Surface Mount ROHS; Working Voltage: 75V; Voltage Rating (DC): 50V; Temperature Coefficient: 25ppm/°C; Number of Terminations: 2; REACH SVHC: Yes; Max Power Dissipation: 100mW; Length: 1.6mm; Width: 800µm; Max Operating Temperature: 155°C; Military Standard: Not; Voltage Rating: 75V; Termination: SMD/SMT; Composition: Thin Film; Height: 450µm; Power Rating: 100mW; China RoHS: Non-Compliant; Lifecycle Status: Production; Min Operating Temperature: -55°C; Case Code (Imperial): 0603; Weight: 2.012816mg; Tolerance: 0.1%; Lead Free: Lead Free; Schedule B: 8533210045, 8533210045; Features: Moisture Resistant; Number of Terminals: 2; RoHS: Compliant; Mounting Technology: Surface Mount; Depth: 800µm; Case/Package: 0603
R140 = CMP-009-00308-1: as R118 on sheet  24V; Pins: 2; Min Operating Temperature: -65°C; Tolerance: 1%; Mounting Technology: Surface Mount; Max Operating Temperature: 170°C; Case/Package: 1206
R141 = CMP-009-00336-1: 500mW Thick Film Resistors 200V ±100ppm/℃ ±1% 1kΩ 1210 Chip Resistor - Surface Mount ROHS; Manufacturer Package Identifier: 1210 (3225 Metric); Temperature Coefficient: 100ppm/°C; China RoHS: Non-Compliant; Introduction Date: 2012-04-10; Length: 3.1mm; Max Operating Temperature: 155°C; REACH SVHC: Yes; Features: Automotive AEC-Q200, Moisture Resistant; Mounting Technology: Surface Mount; Power Rating: 500mW; Lifecycle Status: Production; Max Power Dissipation: 500mW; Case/Package: 1210; Working Voltage: 200V; Export Control Classification Number (ECCN) Code: EAR99; Tolerance: 1%; RoHS: Compliant; Width: 2.6mm; Ratings: AEC-Q200; Schedule B: 8533210045, 8533210045; Number of Terminals: 2; Harmonized Tariff Schedule (HTS) Code: 8533.21.00.30; Country of Origin: Mainland China, Taiwan; Number of Terminations: 2; Min Operating Temperature: -55°C; Composition: Thick Film; Height: 550µm
R142 = CMP-009-00356-1: RES SMD 1M OHM 0.1% 1/8W 0805 / 1 MOhms ±0.1% 0.125W, 1/8W Chip Resistor 0805 (2012 Metric) Thin Film; Voltage Rating: 150V; Max Power Dissipation: 125mW; Temperature Coefficient: 25ppm/°C; Lifecycle Status: Production; Manufacturer Package Identifier: 0805 (2012 metric); Harmonized Tariff Schedule (HTS) Code: 8533.21.00.30; Mounting Technology: Surface Mount; Number of Terminations: 2; Export Control Classification Number (ECCN) Code: EAR99; Introduction Date: 2008-06-09; Country of Origin: Mainland China, Taiwan; Termination: SMD/SMT; RoHS: Compliant; Military Standard: Not; Case Code (Imperial): 0805; Features: Moisture Resistant; China RoHS: Non-Compliant; Schedule B: 8533210045, 8533210045; Lead Free: Lead Free; Length: 2mm; Voltage Rating (DC): 150V; Working Voltage: 150V; Max Operating Temperature: 155°C; Weight: 5.499807mg; Tolerance: 0.1%; Width: 1.25mm; Depth: 1.25mm; REACH SVHC: Yes; Composition: Thin Film; Power Rating: 125mW; Number of Terminals: 2; Min Operating Temperature: -55°C; Height: 500µm; Case/Package: 0805
R143 = CMP-009-00207-1: as R122 on sheet  24V; Mounting Technology: Surface Mount; Case/Package: 0603; Min Operating Temperature: -55°C; Max Operating Temperature: 155°C; Tolerance: 1%
R144 = CMP-009-00343-1: 100mW Thin Film Resistor 75V ±50ppm/℃ ±0.1% 100kΩ 0603 Chip Resistor - Surface Mount ROHS; Temperature Coefficient: 50ppm/°C; Voltage Rating (DC): 50V; Lead Free: Lead Free; Tolerance: 0.1%; Contact Plating: Tin; Schedule B: 8533210045, 8533210045; Composition: Thin Film; Features: Moisture Resistant; Case Code (Imperial): 0603; Depth: 800µm; Power Rating: 100mW; Case/Package: 0603; Number of Terminations: 2; REACH SVHC: Yes; Mounting Technology: Surface Mount; Working Voltage: 75V; RoHS: Compliant; Lifecycle Status: Production; Voltage Rating: 75V; Length: 1.6mm; Min Operating Temperature: -55°C; Military Standard: Not; Height: 450µm; Max Operating Temperature: 155°C; Max Power Dissipation: 100mW; Number of Terminals: 2; Radiation Hardening: No; Width: 800µm; China RoHS: Non-Compliant; Packaging: Tape & Reel (TR)
R145 = CMP-009-00322-1: as R120 on sheet  24V; Min Operating Temperature: -55°C; Case/Package: 0603; Mounting Technology: Surface Mount; Max Operating Temperature: 155°C; Tolerance: 0.1%; Case Code (Imperial): 0603; China RoHS: Non-Compliant; Composition: Thin Film; Country of Origin: Mainland China, Taiwan; Depth: 800µm; Export Control Classification Number (ECCN) Code: EAR99; Features: Moisture Resistant; Harmonized Tariff Schedule (HTS) Code: 8533.21.00.30; Height: 450µm; Introduction Date: 2008-06-09; Lead Free: Lead Free; Length: 1.6mm; Lifecycle Status: Production; Military Standard: Not; Number of Terminals: 2; Number of Terminations: 2; Power Rating: 100mW; REACH SVHC: Yes; RoHS: Compliant; Schedule B: 8533210045, 8533210045; Termination: SMD/SMT; Voltage Rating (DC): 75V; Weight: 2.012816mg; Width: 800µm; Working Voltage: 75V
R146 = CMP-009-00351-1: as R112 on sheet  Connectors; Mounting Technology: Surface Mount; Max Operating Temperature: 155°C; Depth: 800µm; Tolerance: 0.1%; Width: 800µm; Contact Plating: Tin; REACH SVHC: Yes; Working Voltage: 75V; Case/Package: 0603; Number of Terminals: 2; Termination: SMD/SMT; Military Standard: Not; Height: 450µm; Lifecycle Status: Production; Features: Moisture Resistant; Composition: Thin Film; Number of Terminations: 2; Lead Free: Lead Free; Radiation Hardening: No; Temperature Coefficient: 25ppm/°C; Length: 1.6mm; RoHS: Compliant; Min Operating Temperature: -55°C; Power Rating: 100mW; China RoHS: Non-Compliant; Schedule B: 8533210045, 8533210045; Case Code (Imperial): 0603; Country of Origin: Mainland China, Taiwan; Export Control Classification Number (ECCN) Code: EAR99; Harmonized Tariff Schedule (HTS) Code: 8533.21.00.30; Introduction Date: 2008-06-09
TP69-TP71 = CMP-00028-00002-2: 0.6mm round; Pins: 1
U45 = CMP-031-00022-1: as U41 on sheet  24V; Source: MAX17643ATC+.SchLib; Mouser Part Number: 595-LMR51625XDDCR; Manufacturer_Part_Number: LMR51625XDDCR; Arrow Price/Stock: https://www.arrow.com/en/products/lmr51625xddcr/texas-instruments.html?utm_currency=USD&region=nac; Mouser Price/Stock: https://www.mouser.co.uk/ProductDetail/Texas-Instruments/LMR51625XDDCR?qs=efUn273yAheKjJQ13bmSQQ%3D%3D; Height: 1.1mm; Datasheet Link: https://www.ti.com/lit/ds/symlink/lmr51625.pdf?ts=1740555768028; Arrow Part Number: LMR51625XDDCR; Design Item ID: LMR51625XDDCR
U46 = CMP-031-00014-1: Overvoltage, Undervoltage and Reverse Supply Protection Controller; Case/Package: SOT-23-8; Min Operating Temperature: 0°C; Pins: 8; Max Operating Temperature: 70°C
U47 = CMP-014-00006-1: as U42 on sheet  24V; Min Operating Temperature: -40°C; Pins: 6; Max Operating Temperature: 125°C

## Sheet  3V3_Smooth.SchDoc
size 193 x 146 mm; SheetNumber: 25; SheetTotal: 29
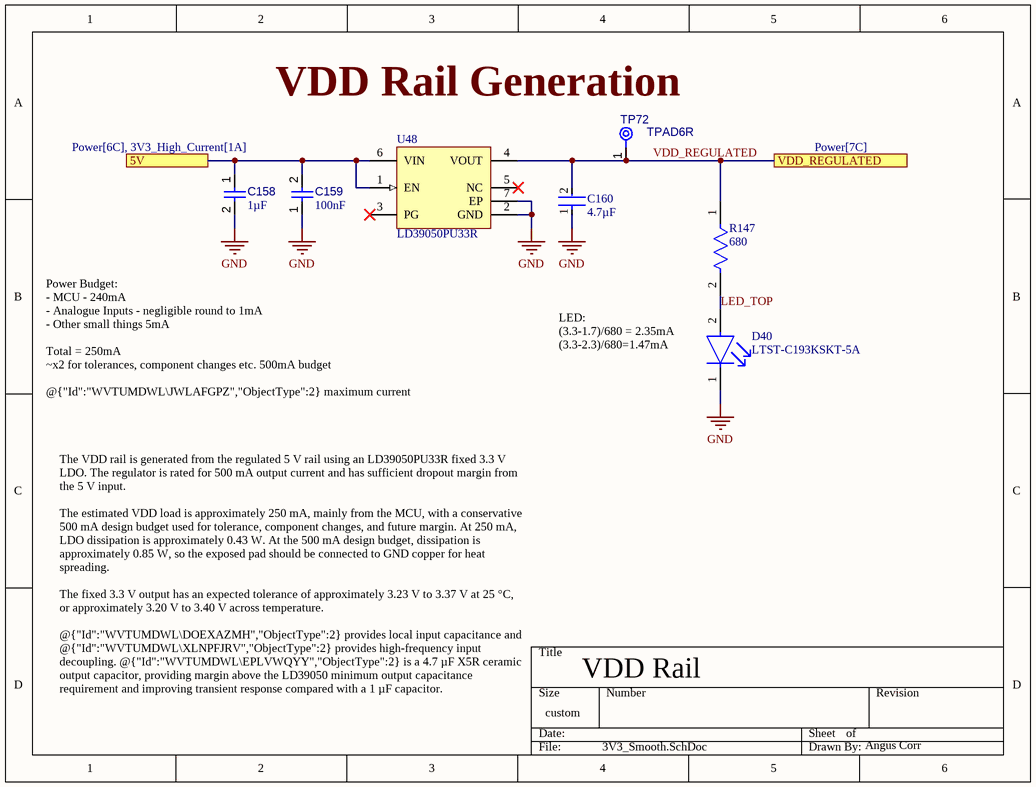
[diagram p23:  3V3_Smooth.SchDoc]

### Parts
C158  value 1µF  [CAPC1608X90X40LL10T20]  (hidden comment: Capacitor 1 uF +/- 10% 25 V 0603)
C159  value 100nF  [CAPC1608X90X40NL10T20]  (hidden comment: Capacitor 100 nF +/-10% 50 V 0603)
C160  value 4.7µF  [FP-GRM21B-0_2-e0_2_0_7-MFG]  (hidden comment: GRM21BZ71H475KE15L)
D40  LTST-C193KSKT-5A  [FP-LTST-C193KGKT-5A-MFG]
R147  value 680  [FP-CRCW0603-e3-IPC_C]  (hidden comment: CRCW0603680RJNEA)
TP72  TPAD6R  [TP06R]  (no BOM)
U48  LD39050PU33R  [DFN6D_L]

### Ports
5V (see Power[6C], 3V3_High_Current[1A]), VDD_REGULATED (see Power[7C])

### Nets
GND: C158.2 C159.1 C160.1 D40.1(C) U48.2(GND) U48.7(EP)
LED_TOP: D40.2(A) R147.2
VDD_REGULATED: C160.2 R147.1 TP72.1(TP) U48.4(VOUT) ; port VDD_REGULATED
NetC158_1: C158.1 C159.2 U48.1(EN) U48.6(VIN) ; port 5V

Not connected (* = marked no-connect by the designer): U48 3(PG)* 5(NC)*

### Notes on the sheet
- VDD Rail Generation
- Power Budget:
  - MCU - 240mA
  - Analogue Inputs - negligible round to 1mA
  - Other small things 5mA
  Total = 250mA
  ~x2 for tolerances, component changes etc. 500mA budget
  @{"Id":"WVTUMDWL\JWLAFGPZ","ObjectType":2} maximum current output of 500mA
- LED:
  (3.3-1.7)/680 = 2.35mA
  (3.3-2.3)/680=1.47mA
- The VDD rail is generated from the regulated 5 V rail using an LD39050PU33R fixed 3.3 V LDO. The regulator is rated for 500 mA output current and has sufficient dropout margin from the 5 V input.
  The estimated VDD load is approximately 250 mA, mainly from the MCU, with a conservative 500 mA design budget used for tolerance, component changes, and future margin. At 250 mA, LDO dissipation is approximately 0.43 W. At the 500 mA design budget, dissipation is approximately 0.85 W, so the exposed pad should be connected to GND copper for heat spreading.
  The fixed 3.3 V output has an expected tolerance of approximately 3.23 V to 3.37 V at 25 °C, or approximately 3.20 V to 3.40 V across temperature.
  @{"Id":"WVTUMDWL\DOEXAZMH","ObjectType":2} provides local input capacitance and @{"Id":"WVTUMDWL\XLNPFJRV","ObjectType":2} provides high-frequency input decoupling. @{"Id":"WVTUMDWL\EPLVWQYY","ObjectType":2} is a 4.7 µF X5R ceramic output capacitor, providing margin above the LD39050 minimum output capacitance requirement and improving transient response compared with a 1 µF capacitor.
  This rail is intended for internal VDD loads only, not as an external 3.3 V supply.
- VDD Rail
- Angus Corr

### Library data of the parts
C158 = CMP-001-00005-6: as C108 on sheet  Connectors; Pins: 2; Mounting Technology: SM; RoHS Compliant: True; Max Operating Temperature: 125°C; Case/Package: 0603; Min Operating Temperature: -55°C; Tolerance: 10%
C159 = CMP-001-00017-6: as C110 on sheet  24V; Tolerance: 10%; Mounting Technology: SM; Max Operating Temperature: 125°C; RoHS Compliant: True; Pins: 2; Case/Package: 0603; Min Operating Temperature: -55°C
C160 = CMP-001-00149-1: as C112 on sheet  24V; Mounting Technology: Surface Mount; Case/Package: 0805; Min Operating Temperature: -55°C; Tolerance: 10%; Max Operating Temperature: 125°C; Voltage Rating: 50V; Country of Origin: Japan, Mainland China, Philippines, Singapore, Thailand; Dielectric Material: Ceramic; Export Control Classification Number (ECCN) Code: EAR99; Harmonized Tariff Schedule (HTS) Code: 8532.24.00.20; Height: 1.25mm; Introduction Date: 2017-02-22; Length: 2mm; Lifecycle Status: Production; Material: Ceramic; Number of Terminals: 2; REACH SVHC: Yes; RoHS: Compliant; Thickness: 1.25mm; Voltage Rating (DC): 50V; Width: 1.25mm
D40 = CMP-007-00044-1: as D26 on sheet  24V; Schedule B: 8541402000, 8541402000; Introduction Date: 2007-04-09; Min Operating Temperature: -55°C; RoHS: Compliant; Terminal Pitch: 1.5mm; Case/Package: 0603; Width: 800µm; Dominant Wavelength: 594.5nm; Pins: 2; Case Code (Imperial): 0603; Height: 350µm; Length: 1.6mm; Color: Yellow; Lead Free: Lead Free; Max Operating Temperature: 85°C; Wavelength: 594.5nm; Harmonized Tariff Schedule (HTS) Code: 8541.40.20.00; China RoHS: Compliant; Illumination Color: Yellow; Number of Terminals: 2; Radiation Hardening: No; Case Code (Metric): 1608; Number of LEDs: 1; Depth: 800µm; Lifecycle Status: Production; REACH SVHC: Yes; Mounting Technology: Surface Mount; Number of Elements: 1
R147 = CMP-009-00300-1: Fixed Resistor, Metal Glaze/Thick Film, 0.1W, 680ohm, 75V, 5% +/-Tol, Surface Mount, 0603; Power Rating: 100mW; Temperature Coefficient: 200ppm/°C; Case/Package: 0603; Voltage Rating (DC): 75V; Lifecycle Status: Production; Depth: 850µm; Introduction Date: 2005-02-16; Number of Terminations: 2; Composition: Thick Film; Export Control Classification Number (ECCN) Code: EAR99; RoHS: Compliant; Packaging: Cut Tape; Max Power Dissipation: 100mW; Max Operating Temperature: 155°C; Harmonized Tariff Schedule (HTS) Code: 8533.21.00.30; Voltage Rating: 75V; China RoHS: Non-Compliant; Width: 850µm; Height: 450µm; Schedule B: 8533210045, 8533210045; Mounting Technology: Surface Mount; Pins: 2; Radiation Hardening: No; Features: Automotive AEC-Q200; Min Operating Temperature: -55°C; Lead Free: Lead Free; Working Voltage: 75V; Military Standard: Not; Tolerance: 5%; Case Code (Imperial): 0603; Number of Terminals: 2; Weight: 2.012816mg; REACH SVHC: Yes; Length: 1.55mm; Ratings: AEC-Q200; Contact Plating: Tin; Termination: SMD/SMT; Country of Origin: Israel, Taiwan
TP72 = CMP-00028-00002-2: 0.6mm round; Pins: 1
U48 = CMP-019-00056-1: 500 mA low quiescent current low noise voltage regulator; Max Supply Voltage: 5.5V; Output Current: 500mA; Output Voltage: 3.3V; Dropout Voltage: 400mV; Max Operating Temperature: 125°C; Case/Package: DFN EP; Pins: 6; Mounting Technology: Surface Mount; Min Operating Temperature: -40°C